# EAGLE schematic RPi Zero W Breakout 0.3 (EAGLE 9.3.1)
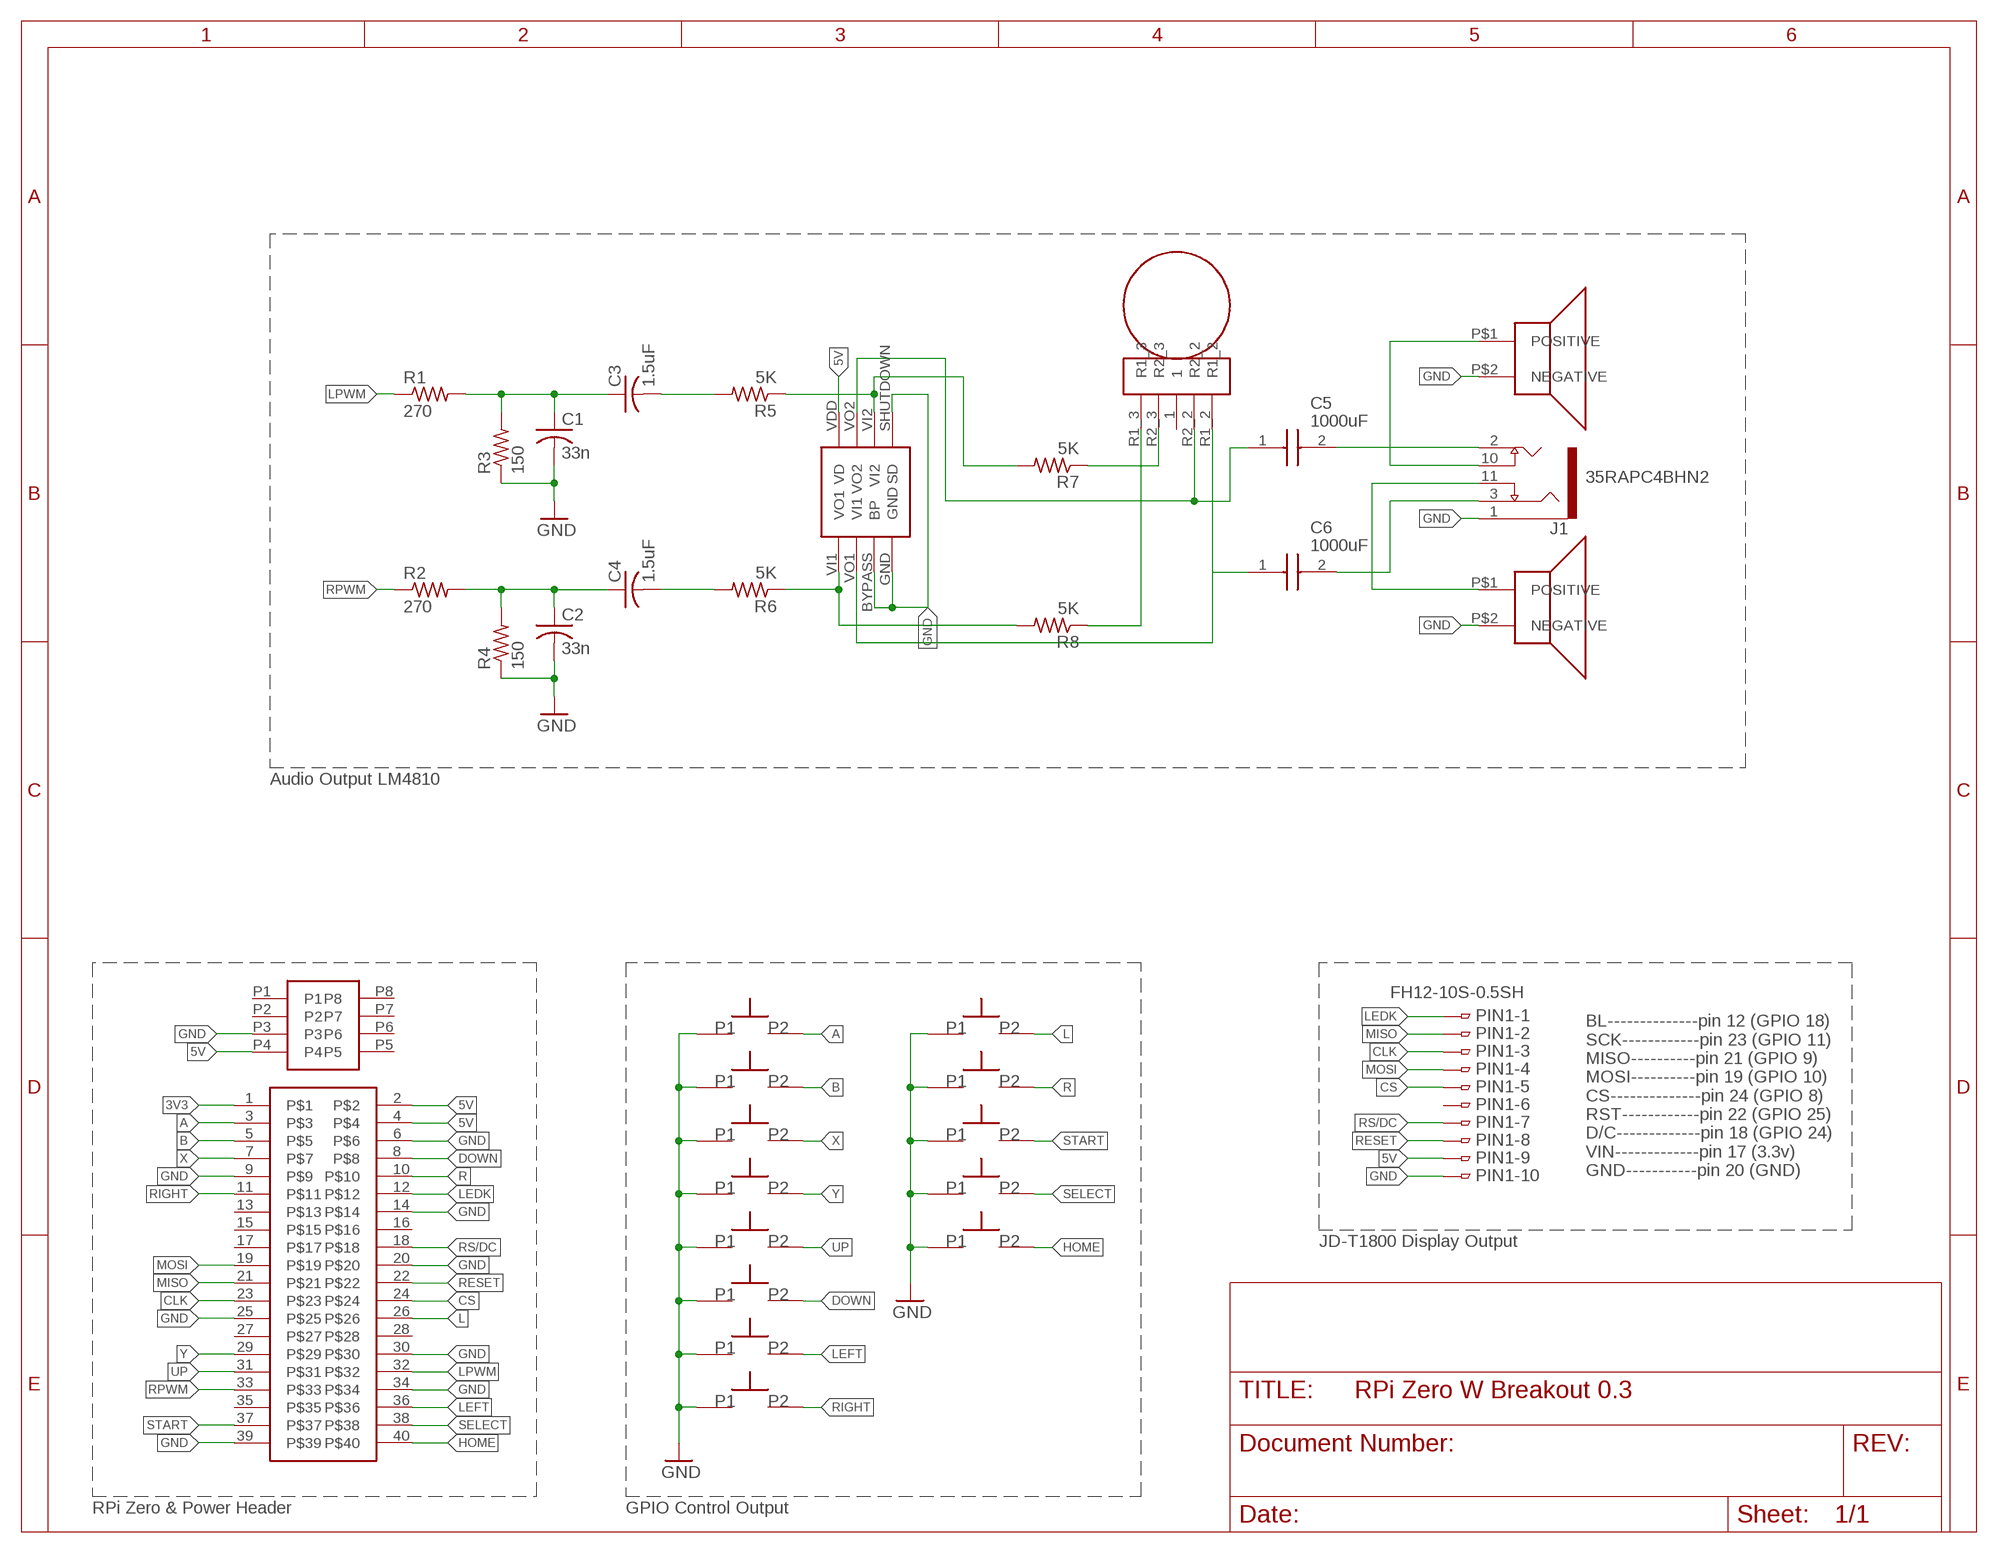
[diagram p0: schematic, sheet 1]

## Parts
A  SPST_TACTILE_SWITCH  [SPST_TACTILESWITCH_TL3301PF160QG]
B  SPST_TACTILESWITCH_TL3301PF160QG  [SPST_TACTILESWITCH_TL3301PF160QG]
C1  33n  C-USC0805K  [C0805K]
C2  33n  C-USC0805K  [C0805K]
C3  1.5uF  C-USC0805K  [C0805K]
C4  1.5uF  C-USC0805K  [C0805K]
C5  1000uF  UWT0J102MNL1GS  [UWT(8X10)]
C6  1000uF  UWT0J102MNL1GS  [UWT(8X10)]
DOWN  SPST_TACTILESWITCH_TL3301PF160QG  [SPST_TACTILESWITCH_TL3301PF160QG]
HOME  SPST_TACTILESWITCH_TL3301PF160QG  [SPST_TACTILESWITCH_TL3301PF160QG]
J1  35RAPC4BHN2  [SWITCHCRAFT_35RAPC4BHN2]
LEFT  SPST_TACTILESWITCH_TL3301PF160QG  [SPST_TACTILESWITCH_TL3301PF160QG]
LSPK  SP-1208  [SP-1208]
PIN1  FH12-10S-0.5SH  [FH12-10S-0.5SH]
R1  270  R-US_R0805  [R0805]
R2  270  R-US_R0805  [R0805]
R3  150  R-US_R0805  [R0805]
R4  150  R-US_R0805  [R0805]
R5  5K  R-US_R0805  [R0805]
R6  5K  R-US_R0805  [R0805]
R7  5K  R-US_R0805  [R0805]
R8  5K  R-US_R0805  [R0805]
RF  RK14J12A0A0K  [RK14J12A0A0K]
RIGHT  SPST_TACTILESWITCH_TL3301PF160QG  [SPST_TACTILESWITCH_TL3301PF160QG]
RSPK  SP-1208  [SP-1208]
SELECT  SPST_TACTILESWITCH_TL3301PF160QG  [SPST_TACTILESWITCH_TL3301PF160QG]
START  SPST_TACTILE_SWITCH  [SPST_TACTILESWITCH_TL3301PF160QG]
U$1  RPI_ZERO  [RPI_ZERO]
U$2  LM4810MM/NOPBCT-ND  [NOPBCT-ND]
U$3  M22-6340442  [M22-6340442]
U$4  SPST_TACTILE_SWITCHRIGHTANGLEBENT  [SPST_TACTILESWITCH_TL3360CF185Q_BENTFRAME]
U$5  SPST_TACTILE_SWITCHRIGHTANGLEBENT  [SPST_TACTILESWITCH_TL3360CF185Q_BENTFRAME]
UP  SPST_TACTILESWITCH_TL3301PF160QG  [SPST_TACTILESWITCH_TL3301PF160QG]
X  SPST_TACTILESWITCH_TL3301PF160QG  [SPST_TACTILESWITCH_TL3301PF160QG]
Y  SPST_TACTILESWITCH_TL3301PF160QG  [SPST_TACTILESWITCH_TL3301PF160QG]

## Nets
3V3: U$1.1
5V: PIN1.9 U$1.2 U$1.4 U$2.VDD(VD) U$3.P4
A: A.P$3 U$1.3
B: B.P$3 U$1.5
CLK: PIN1.3 U$1.23
CS: PIN1.5 U$1.24
DOWN: DOWN.P$3 U$1.8
GND: A.P$1 B.P$1 C1.2 C2.2 DOWN.P$1 HOME.P$1 J1.1 LEFT.P$1 LSPK.P$2(NEGATIVE) PIN1.10 R3.1 R4.1 RIGHT.P$1 RSPK.P$2(NEGATIVE) SELECT.P$1 START.P$1 U$1.6 U$1.9 U$1.14 U$1.20 U$1.25 U$1.30 U$1.34 U$1.39 U$2.BYPASS(BP) U$2.GND U$2.SHUTDOWN(SD) U$3.P3 U$4.P$1 U$5.P$1 UP.P$1 X.P$1 Y.P$1
HOME: HOME.P$3 U$1.40
L: U$1.26 U$4.P$2
LEDK: PIN1.1 U$1.12
LEFT: LEFT.P$3 U$1.36
LPWM: R1.1 U$1.32
MISO: PIN1.2 U$1.21
MOSI: PIN1.4 U$1.19
N$1: C1.1 C3.1 R1.2 R3.2
N$2: C2.1 C4.1 R2.2 R4.2
N$4: C3.2 R5.2
N$5: R7.1 RF.R2_3
N$6: C4.2 R6.2
N$7: R8.1 RF.R1_3
N$8: C6.1(+) RF.R1_2 U$2.VO1(VI1)
N$9: C5.1(+) RF.R2_2 U$2.VO2
N$10: C5.2(-) J1.2
N$11: C6.2(-) J1.3
N$12: J1.10 LSPK.P$1(POSITIVE)
N$13: J1.11 RSPK.P$1(POSITIVE)
N$14: R5.1 R7.2 U$2.VI2
N$15: R6.1 R8.2 U$2.VI1(VO1)
R: U$1.10 U$5.P$2
RESET: PIN1.8 U$1.22
RIGHT: RIGHT.P$3 U$1.11
RPWM: R2.1 U$1.33
RS/DC: PIN1.7 U$1.18
SELECT: SELECT.P$3 U$1.38
START: START.P$3 U$1.37
UP: U$1.31 UP.P$3
X: U$1.7 X.P$3
Y: U$1.29 Y.P$3
Unconnected: PIN1.6 RF.1 U$1.13 U$1.15 U$1.16 U$1.17 U$1.27 U$1.28 U$1.35 U$3.P1 U$3.P2 U$3.P5 U$3.P6 U$3.P7 U$3.P8

## Notes on the sheet
- Audio Output LM4810
- BL--------------pin 12 (GPIO 18)
  SCK------------pin 23 (GPIO 11)
  MISO----------pin 21 (GPIO 9)
  MOSI----------pin 19 (GPIO 10)
  CS--------------pin 24 (GPIO 8)
  RST------------pin 22 (GPIO 25)
  D/C-------------pin 18 (GPIO 24)
  VIN-------------pin 17 (3.3v)
  GND-----------pin 20 (GND)
- JD-T1800 Display Output
- RPi Zero & Power Header | GPIO Control Output

## Library data of the parts
A START = switches:SPST_TACTILE_SWITCH: SMD SPST Tactile Switch
B DOWN HOME LEFT RIGHT SELECT UP X Y = switches:SPST_TACTILESWITCH_TL3301PF160QG: SMD SPST
C1-C4 = rcl:C-US: CAPACITOR, American symbol; SPICEPREFIX: C
C5 C6 = SamacSys_Parts:UWT0J102MNL1GS: Nichicon 1000uF +/-20% 6.3 V 5101-4 SMD Metal Can Aluminium Electrolytic Capacitor Source: Datasheet <https://componentsearchengine.com/Datasheets/1/UWT0J102MNL1GS.pdf>; DESCRIPTION: Nichicon 1000uF +/-20% 6.3 V 5101-4 SMD Metal Can Aluminium Electrolytic Capacitor; HEIGHT: mm; MANUFACTURER_NAME: Nichicon; MANUFACTURER_PART_NUMBER: UWT0J102MNL1GS; MOUSER_PART_NUMBER: 647-UWT0J102MNL1S
J1 = 35RAPC4BHN2:35RAPC4BHN2: Conn 3.5MM Stereo Jack F 5 POS Solder RA Thru-Hole 5 Terminal 1 Port; DESCRIPTION: Conn 3.5MM Stereo Jack F 5 POS Solder RA Thru-Hole 5 Terminal 1 Port; DIGI-KEY_PART_NUMBER: SC1459-ND; DIGI-KEY_PURCHASE_URL: https://www.digikey.com/product-detail/en/switchcraft-inc/35RAPC4BHN2/SC1459-ND/1288690?utm_source=snapeda&utm_medium=aggregator&utm_campaign=symbol; MF: Switchcraft; MP: 35RAPC4BHN2; PACKAGE: None
LSPK RSPK = SP-1208:SP-1208: SPEAKER 8OHM 250MW TOP PORT 63DB
PIN1 = con-hirose:FH12-10S-0.5S: 0.5mm Pitch Connectors For FPC/FFC Source: Data sheet <http://www.hirose.co.jp/cataloge_hp/e58605370.pdf>; MPN: FH12-10S-0.5SH(55); OC_FARNELL: 1324540; OC_NEWARK: 34M6152
R1-R8 = rcl:R-US_: RESISTOR, American symbol; SPICEPREFIX: R
RF = RK14J12A0A0K:RK14J12A0A0K: Potentiometers Dual Unit 14mm 3B insertion (2mm)
U$1 = RaspberryPi:RPI_ZERO
U$2 = LM4810MM:LM4810MM/NOPBCT-ND: Dual 105mW Headphone Amplifier with Active-High Shutdown Mode
U$3 = M22-6340442:M22-6340442: 8 Pin Header 2.0mm pitch
U$4 U$5 = switches:SPST_TACTILE_SWITCH: SMD SPST Tactile Switch; SPICEPREFIX: B